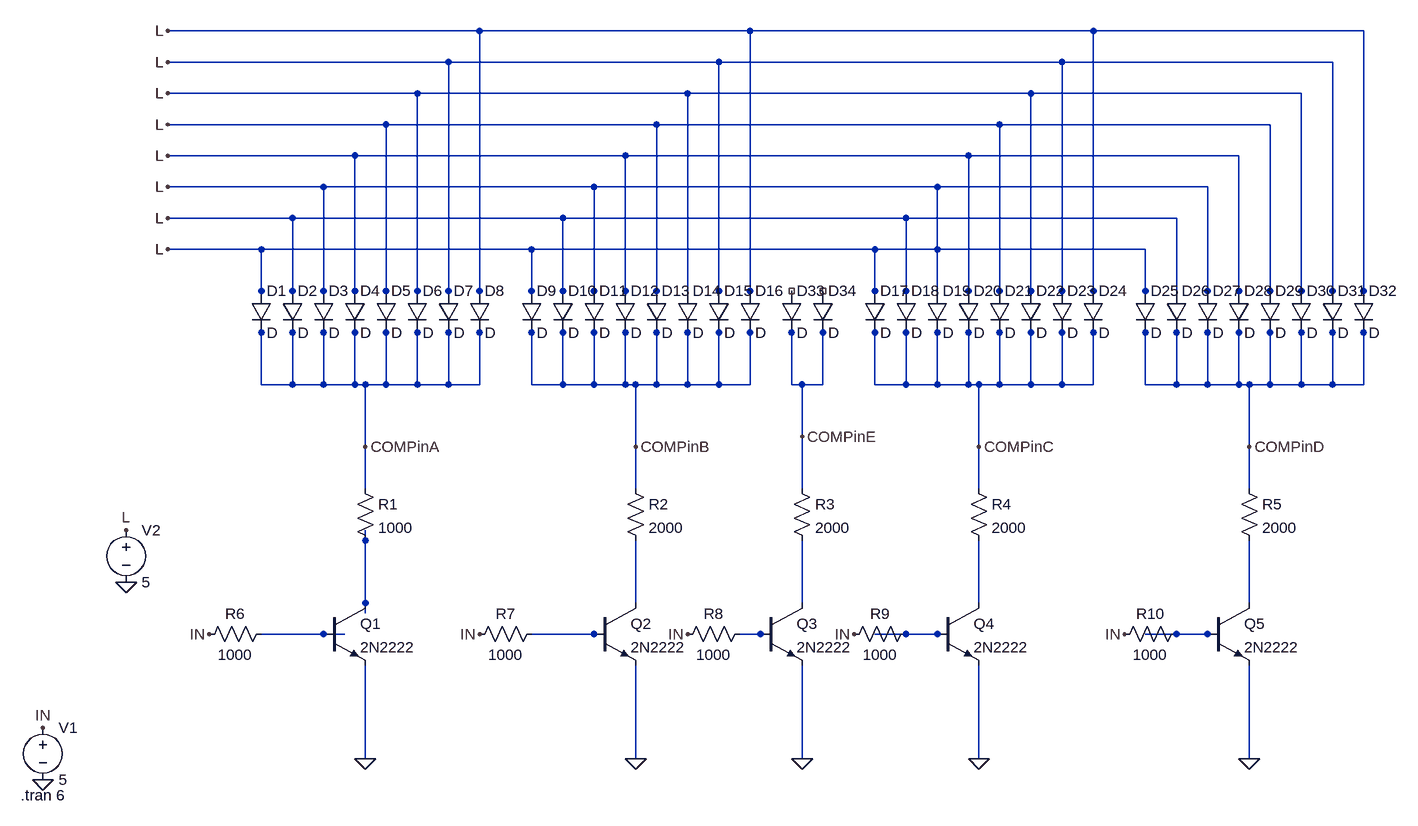
[diagram p0: schematic LEDDisplaySimulation.asc]
LEDDisplaySimulation.asc, the LTspice schematic file:
Version 4
SHEET 1 1640 680
WIRE 192 -512 -288 -512
WIRE 608 -512 192 -512
WIRE 1136 -512 608 -512
WIRE 1552 -512 1136 -512
WIRE 144 -464 -288 -464
WIRE 560 -464 144 -464
WIRE 1088 -464 560 -464
WIRE 1504 -464 1088 -464
WIRE 96 -416 -288 -416
WIRE 512 -416 96 -416
WIRE 1040 -416 512 -416
WIRE 1456 -416 1040 -416
WIRE 48 -368 -288 -368
WIRE 464 -368 48 -368
WIRE 992 -368 464 -368
WIRE 1408 -368 992 -368
WIRE 0 -320 -288 -320
WIRE 416 -320 0 -320
WIRE 944 -320 416 -320
WIRE 1360 -320 944 -320
WIRE -48 -272 -288 -272
WIRE 368 -272 -48 -272
WIRE 896 -272 368 -272
WIRE 1312 -272 896 -272
WIRE -96 -224 -288 -224
WIRE 320 -224 -96 -224
WIRE 848 -224 320 -224
WIRE 1264 -224 848 -224
WIRE -144 -176 -288 -176
WIRE 272 -176 -144 -176
WIRE 800 -176 272 -176
WIRE 896 -176 896 -272
WIRE 896 -176 800 -176
WIRE 1216 -176 896 -176
WIRE -144 -112 -144 -176
WIRE -96 -112 -96 -224
WIRE -48 -112 -48 -272
WIRE 0 -112 0 -320
WIRE 48 -112 48 -368
WIRE 96 -112 96 -416
WIRE 144 -112 144 -464
WIRE 192 -112 192 -512
WIRE 272 -112 272 -176
WIRE 320 -112 320 -224
WIRE 368 -112 368 -272
WIRE 416 -112 416 -320
WIRE 464 -112 464 -368
WIRE 512 -112 512 -416
WIRE 560 -112 560 -464
WIRE 608 -112 608 -512
WIRE 800 -112 800 -176
WIRE 848 -112 848 -224
WIRE 896 -112 896 -176
WIRE 944 -112 944 -320
WIRE 992 -112 992 -368
WIRE 1040 -112 1040 -416
WIRE 1088 -112 1088 -464
WIRE 1136 -112 1136 -512
WIRE 1216 -112 1216 -176
WIRE 1264 -112 1264 -224
WIRE 1312 -112 1312 -272
WIRE 1360 -112 1360 -320
WIRE 1408 -112 1408 -368
WIRE 1456 -112 1456 -416
WIRE 1504 -112 1504 -464
WIRE 1552 -112 1552 -512
WIRE -144 -96 -144 -112
WIRE -96 -96 -96 -112
WIRE -48 -96 -48 -112
WIRE 0 -96 0 -112
WIRE 48 -96 48 -112
WIRE 96 -96 96 -112
WIRE 144 -96 144 -112
WIRE 192 -96 192 -112
WIRE 272 -96 272 -112
WIRE 320 -96 320 -112
WIRE 368 -96 368 -112
WIRE 416 -96 416 -112
WIRE 464 -96 464 -112
WIRE 560 -96 560 -112
WIRE 608 -96 608 -112
WIRE 800 -96 800 -112
WIRE 848 -96 848 -112
WIRE 944 -96 944 -112
WIRE 992 -96 992 -112
WIRE 1040 -96 1040 -112
WIRE 1088 -96 1088 -112
WIRE 1136 -96 1136 -112
WIRE 1216 -96 1216 -112
WIRE 1312 -96 1312 -112
WIRE 1360 -96 1360 -112
WIRE 1408 -96 1408 -112
WIRE 1456 -96 1456 -112
WIRE 1504 -96 1504 -112
WIRE 1552 -96 1552 -112
WIRE -144 -48 -144 -64
WIRE -96 -48 -96 -64
WIRE -48 -48 -48 -64
WIRE 0 -48 0 -64
WIRE 48 -48 48 -64
WIRE 96 -48 96 -64
WIRE 144 -48 144 -64
WIRE 192 -48 192 -64
WIRE 272 -48 272 -64
WIRE 320 -48 320 -64
WIRE 368 -48 368 -64
WIRE 416 -48 416 -64
WIRE 464 -48 464 -64
WIRE 512 -48 512 -64
WIRE 560 -48 560 -64
WIRE 608 -48 608 -64
WIRE 672 -48 672 -64
WIRE 720 -48 720 -64
WIRE 800 -48 800 -64
WIRE 848 -48 848 -64
WIRE 896 -48 896 -64
WIRE 944 -48 944 -64
WIRE 992 -48 992 -64
WIRE 1040 -48 1040 -64
WIRE 1088 -48 1088 -64
WIRE 1136 -48 1136 -64
WIRE 1216 -48 1216 -64
WIRE 1264 -48 1264 -64
WIRE 1312 -48 1312 -64
WIRE 1360 -48 1360 -64
WIRE 1408 -48 1408 -64
WIRE 1456 -48 1456 -64
WIRE 1504 -48 1504 -64
WIRE 1552 -48 1552 -64
WIRE -144 32 -144 -48
WIRE -96 32 -96 -48
WIRE -96 32 -144 32
WIRE -48 32 -48 -48
WIRE -48 32 -96 32
WIRE 0 32 0 -48
WIRE 0 32 -48 32
WIRE 16 32 0 32
WIRE 48 32 48 -48
WIRE 48 32 16 32
WIRE 96 32 96 -48
WIRE 96 32 48 32
WIRE 144 32 144 -48
WIRE 144 32 96 32
WIRE 192 32 192 -48
WIRE 192 32 144 32
WIRE 272 32 272 -48
WIRE 320 32 320 -48
WIRE 320 32 272 32
WIRE 368 32 368 -48
WIRE 368 32 320 32
WIRE 416 32 416 -48
WIRE 416 32 368 32
WIRE 432 32 416 32
WIRE 464 32 464 -48
WIRE 464 32 432 32
WIRE 512 32 512 -48
WIRE 512 32 464 32
WIRE 560 32 560 -48
WIRE 560 32 512 32
WIRE 608 32 608 -48
WIRE 608 32 560 32
WIRE 672 32 672 -48
WIRE 688 32 672 32
WIRE 720 32 720 -48
WIRE 720 32 688 32
WIRE 800 32 800 -48
WIRE 848 32 848 -48
WIRE 848 32 800 32
WIRE 896 32 896 -48
WIRE 896 32 848 32
WIRE 944 32 944 -48
WIRE 944 32 896 32
WIRE 960 32 944 32
WIRE 992 32 992 -48
WIRE 992 32 960 32
WIRE 1040 32 1040 -48
WIRE 1040 32 992 32
WIRE 1088 32 1088 -48
WIRE 1088 32 1040 32
WIRE 1136 32 1136 -48
WIRE 1136 32 1088 32
WIRE 1216 32 1216 -48
WIRE 1264 32 1264 -48
WIRE 1264 32 1216 32
WIRE 1312 32 1312 -48
WIRE 1312 32 1264 32
WIRE 1360 32 1360 -48
WIRE 1360 32 1312 32
WIRE 1376 32 1360 32
WIRE 1408 32 1408 -48
WIRE 1408 32 1376 32
WIRE 1456 32 1456 -48
WIRE 1456 32 1408 32
WIRE 1504 32 1504 -48
WIRE 1504 32 1456 32
WIRE 1552 32 1552 -48
WIRE 1552 32 1504 32
WIRE 688 112 688 32
WIRE 16 128 16 32
WIRE 432 128 432 32
WIRE 960 128 960 32
WIRE 1376 128 1376 32
WIRE 16 192 16 128
WIRE 432 192 432 128
WIRE 688 192 688 112
WIRE 960 192 960 128
WIRE 1376 192 1376 128
WIRE 16 272 16 256
WIRE 16 368 16 272
WIRE 432 368 432 272
WIRE 688 368 688 272
WIRE 960 368 960 272
WIRE 1376 368 1376 272
WIRE 16 384 16 368
WIRE -48 416 -144 416
WIRE -16 416 -48 416
WIRE 368 416 272 416
WIRE 384 416 368 416
WIRE 624 416 592 416
WIRE 640 416 624 416
WIRE 848 416 800 416
WIRE 896 416 848 416
WIRE 912 416 896 416
WIRE 1264 416 1216 416
WIRE 1312 416 1264 416
WIRE 1328 416 1312 416
WIRE 16 608 16 464
WIRE 432 608 432 464
WIRE 688 608 688 464
WIRE 960 608 960 464
WIRE 1376 608 1376 464
FLAG 16 128 COMPinA
FLAG 432 128 COMPinB
FLAG 960 128 COMPinC
FLAG 1376 128 COMPinD
FLAG 688 112 COMPinE
FLAG 16 608 0
FLAG 432 608 0
FLAG 688 608 0
FLAG 960 608 0
FLAG 1376 608 0
FLAG 192 416 IN
FLAG -224 416 IN
FLAG 512 416 IN
FLAG 768 416 IN
FLAG 1184 416 IN
FLAG -480 560 IN
FLAG -480 640 0
FLAG -352 336 0
FLAG -352 256 L
FLAG -288 -176 L
FLAG -288 -224 L
FLAG -288 -272 L
FLAG -288 -320 L
FLAG -288 -368 L
FLAG -288 -416 L
FLAG -288 -464 L
FLAG -288 -512 L
SYMBOL diode -160 -112 R0
SYMATTR InstName D1
SYMBOL diode -112 -112 R0
SYMATTR InstName D2
SYMBOL diode -64 -112 R0
SYMATTR InstName D3
SYMBOL diode -16 -112 R0
SYMATTR InstName D4
SYMBOL diode 32 -112 R0
SYMATTR InstName D5
SYMBOL diode 80 -112 R0
SYMATTR InstName D6
SYMBOL diode 128 -112 R0
SYMATTR InstName D7
SYMBOL diode 176 -112 R0
SYMATTR InstName D8
SYMBOL diode 256 -112 R0
SYMATTR InstName D9
SYMBOL diode 304 -112 R0
SYMATTR InstName D10
SYMBOL diode 352 -112 R0
SYMATTR InstName D11
SYMBOL diode 400 -112 R0
SYMATTR InstName D12
SYMBOL diode 448 -112 R0
SYMATTR InstName D13
SYMBOL diode 496 -112 R0
SYMATTR InstName D14
SYMBOL diode 544 -112 R0
SYMATTR InstName D15
SYMBOL diode 592 -112 R0
SYMATTR InstName D16
SYMBOL diode 784 -112 R0
SYMATTR InstName D17
SYMBOL diode 832 -112 R0
SYMATTR InstName D18
SYMBOL diode 880 -112 R0
SYMATTR InstName D19
SYMBOL diode 928 -112 R0
SYMATTR InstName D20
SYMBOL diode 976 -112 R0
SYMATTR InstName D21
SYMBOL diode 1024 -112 R0
SYMATTR InstName D22
SYMBOL diode 1072 -112 R0
SYMATTR InstName D23
SYMBOL diode 1120 -112 R0
SYMATTR InstName D24
SYMBOL diode 1200 -112 R0
SYMATTR InstName D25
SYMBOL diode 1248 -112 R0
SYMATTR InstName D26
SYMBOL diode 1296 -112 R0
SYMATTR InstName D27
SYMBOL diode 1344 -112 R0
SYMATTR InstName D28
SYMBOL diode 1392 -112 R0
SYMATTR InstName D29
SYMBOL diode 1440 -112 R0
SYMATTR InstName D30
SYMBOL diode 1488 -112 R0
SYMATTR InstName D31
SYMBOL diode 1536 -112 R0
SYMATTR InstName D32
SYMBOL diode 656 -112 R0
SYMATTR InstName D33
SYMBOL diode 704 -112 R0
SYMATTR InstName D34
SYMBOL res 0 176 R0
SYMATTR InstName R1
SYMATTR Value 1000
SYMBOL res 416 176 R0
SYMATTR InstName R2
SYMATTR Value 2000
SYMBOL res 672 176 R0
SYMATTR InstName R3
SYMATTR Value 2000
SYMBOL res 944 176 R0
SYMATTR InstName R4
SYMATTR Value 2000
SYMBOL res 1360 176 R0
SYMATTR InstName R5
SYMATTR Value 2000
SYMBOL npn -48 368 R0
SYMATTR InstName Q1
SYMATTR Value 2N2222
SYMBOL npn 368 368 R0
SYMATTR InstName Q2
SYMATTR Value 2N2222
SYMBOL npn 624 368 R0
SYMATTR InstName Q3
SYMATTR Value 2N2222
SYMBOL npn 896 368 R0
SYMATTR InstName Q4
SYMATTR Value 2N2222
SYMBOL npn 1312 368 R0
SYMATTR InstName Q5
SYMATTR Value 2N2222
SYMBOL res -128 400 R90
WINDOW 0 0 56 VBottom 2
WINDOW 3 32 56 VTop 2
SYMATTR InstName R6
SYMATTR Value 1000
SYMBOL res 288 400 R90
WINDOW 0 0 56 VBottom 2
WINDOW 3 32 56 VTop 2
SYMATTR InstName R7
SYMATTR Value 1000
SYMBOL res 608 400 R90
WINDOW 0 0 56 VBottom 2
WINDOW 3 32 56 VTop 2
SYMATTR InstName R8
SYMATTR Value 1000
SYMBOL res 864 400 R90
WINDOW 0 0 56 VBottom 2
WINDOW 3 32 56 VTop 2
SYMATTR InstName R9
SYMATTR Value 1000
SYMBOL res 1280 400 R90
WINDOW 0 0 56 VBottom 2
WINDOW 3 32 56 VTop 2
SYMATTR InstName R10
SYMATTR Value 1000
SYMBOL voltage -480 544 R0
WINDOW 123 0 0 Left 2
WINDOW 39 0 0 Left 2
SYMATTR InstName V1
SYMATTR Value 5
SYMBOL voltage -352 240 R0
WINDOW 123 0 0 Left 2
WINDOW 39 0 0 Left 2
SYMATTR InstName V2
SYMATTR Value 5
TEXT -514 664 Left 2 !.tran 6

The netlist it stands for:
* LEDDisplaySimulation.asc
D1 L COMPinA D
D2 L COMPinA D
D3 L COMPinA D
D4 L COMPinA D
D5 L COMPinA D
D6 L COMPinA D
D7 L COMPinA D
D8 L COMPinA D
D9 L COMPinB D
D10 L COMPinB D
D11 L COMPinB D
D12 L COMPinB D
D13 L COMPinB D
D14 L COMPinB D
D15 L COMPinB D
D16 L COMPinB D
D17 L COMPinC D
D18 L COMPinC D
D19 L COMPinC D
D20 L COMPinC D
D21 L COMPinC D
D22 L COMPinC D
D23 L COMPinC D
D24 L COMPinC D
D25 L COMPinD D
D26 L COMPinD D
D27 L COMPinD D
D28 L COMPinD D
D29 L COMPinD D
D30 L COMPinD D
D31 L COMPinD D
D32 L COMPinD D
D33 NC_01 COMPinE D
D34 NC_02 COMPinE D
R1 COMPinA N001 1000
R2 COMPinB N002 2000
R3 COMPinE N003 2000
R4 COMPinC N004 2000
R5 COMPinD N005 2000
Q1 N001 N006 0 0 2N2222
Q2 N002 N007 0 0 2N2222
Q3 N003 N008 0 0 2N2222
Q4 N004 N009 0 0 2N2222
Q5 N005 N010 0 0 2N2222
R6 N006 IN 1000
R7 N007 IN 1000
R8 N008 IN 1000
R9 N009 IN 1000
R10 N010 IN 1000
V1 IN 0 5
V2 L 0 5
.model D D
.lib standard.dio
.model NPN NPN
.model PNP PNP
.lib standard.bjt
.tran 6
.backanno
.end